# Altium project LimeNet-Micro_2v1-SDR.PrjPcb (part 11 of 11)
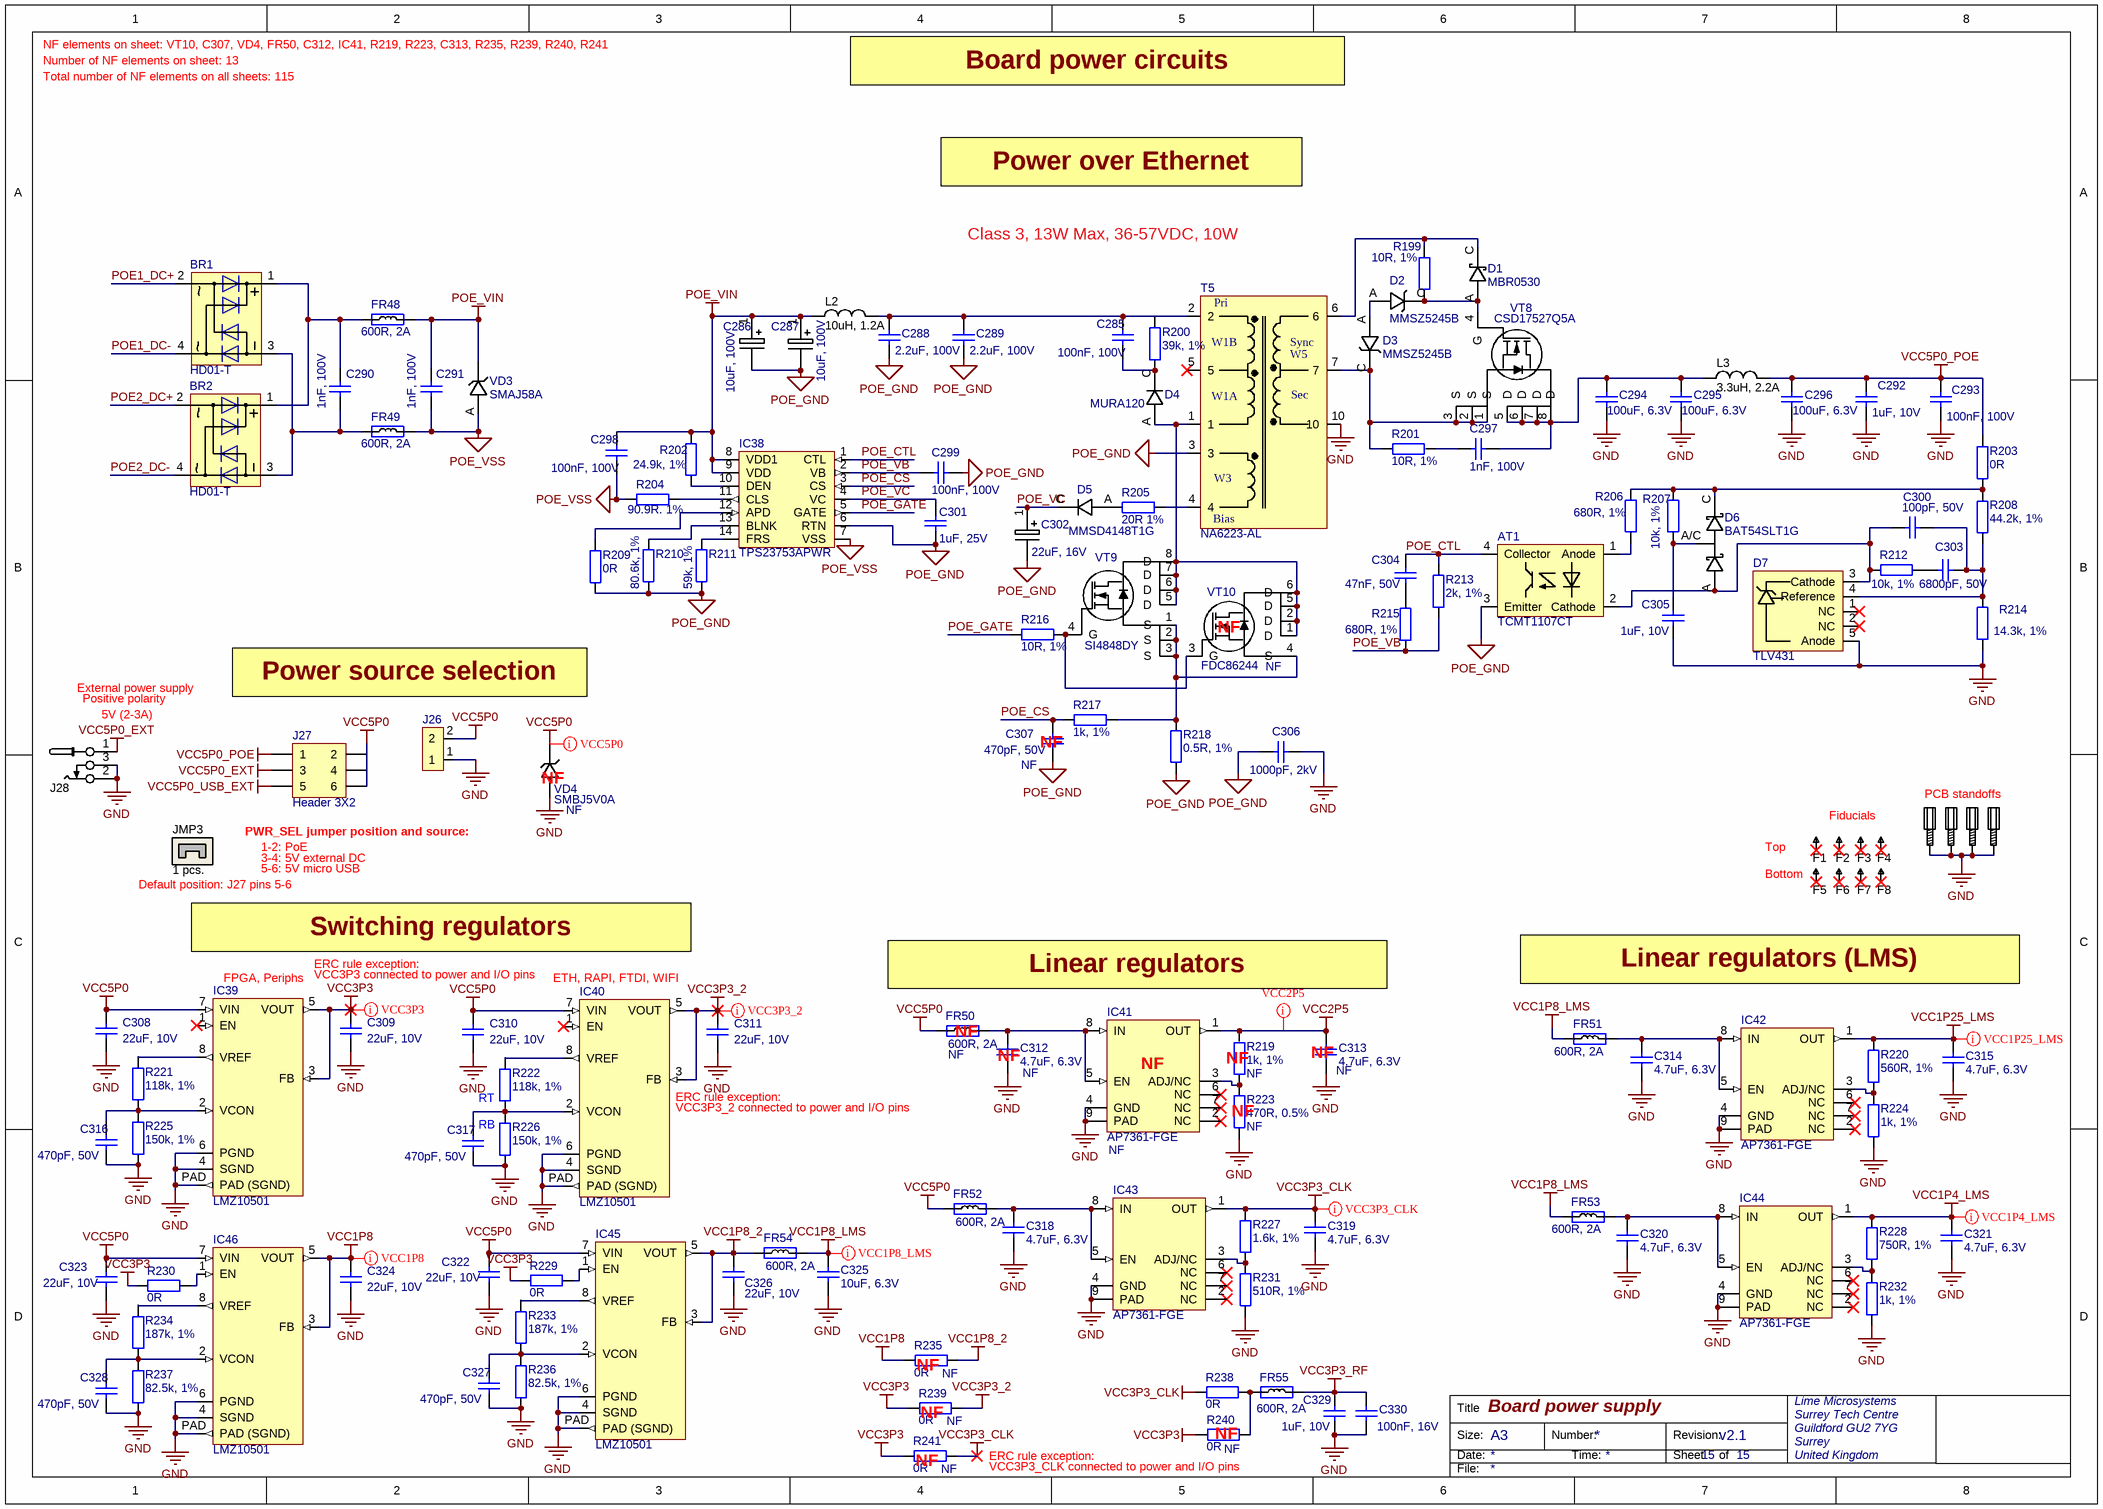
[diagram p116: 15_PowerSupply.SchDoc]

## Nets that join several sheets
GND: 05_LMS7002M_Misc (17 pins), 06_LMS7002M_RF (82 pins), 07_LMS7002M_Power (84 pins), 08_FPGA (61 pins), 09_Misc (63 pins), 10_USB_Ethernet (47 pins), 11_USB_FIFO (33 pins), 12_Raspbbery CM3 (80 pins), 13_Raspberry_Misc (73 pins), 14_Clocks (74 pins), 15_PowerSupply (69 pins)
RAPI_VDAC: 12_Raspbbery CM3 (5 pins), 13_Raspberry_Misc (VD2.2)
VCC1P4_LMS: 07_LMS7002M_Power (7 pins), 15_PowerSupply (C321.2 IC44.1 R228.1)
VCC1P8: 08_FPGA (11 pins), 09_Misc (R43.2 R69.1), 12_Raspbbery CM3 (R117.2 R124.1 R131.1), 13_Raspberry_Misc (5 pins), 15_PowerSupply (C324.2 IC46.3 IC46.5 R235.2)
VCC1P8_2: 14_Clocks (FR45.1), 15_PowerSupply (5 pins)
VCC1P8_LMS: 06_LMS7002M_RF (12 pins), 07_LMS7002M_Power (11 pins), 15_PowerSupply (C325.2 FR51.1 FR53.1 FR54.2)
VCC1P25_LMS: 07_LMS7002M_Power (18 pins), 15_PowerSupply (C315.2 IC42.1 R220.2)
VCC2P5: 12_Raspbbery CM3 (R128.1), 14_Clocks (R186.2), 15_PowerSupply (C313.2 IC41.1 R219.2)
VCC3P3: 05_LMS7002M_Misc (10 pins), 07_LMS7002M_Power (FR1.2), 08_FPGA (46 pins), 09_Misc (39 pins), 10_USB_Ethernet (J9.P6 J9.P12), 13_Raspberry_Misc (7 pins), 15_PowerSupply (8 pins)
VCC3P3_2: 10_USB_Ethernet (22 pins), 11_USB_FIFO (21 pins), 12_Raspbbery CM3 (13 pins), 13_Raspberry_Misc (19 pins), 15_PowerSupply (C311.2 IC40.3 IC40.5 R239.1)
VCC3P3_CLK: 09_Misc (FR36.1), 14_Clocks (12 pins), 15_PowerSupply (5 pins)
VCC3P3_RF: 06_LMS7002M_RF (8 pins), 15_PowerSupply (C329.2 C330.1 FR55.2)
VCC5P0: 08_FPGA (J3.7 R33.1), 09_Misc (R61.1), 10_USB_Ethernet (6 pins), 11_USB_FIFO (R103.2), 12_Raspbbery CM3 (R120.2), 13_Raspberry_Misc (6 pins), 15_PowerSupply (15 pins)
VCC5P0_USB_EXT: 10_USB_Ethernet (J12.4), 12_Raspbbery CM3 (J14.1 R122.1), 13_Raspberry_Misc (J15.1), 15_PowerSupply (J27.5)
ADF_MUXOUT: 08_FPGA (IC12.C10), 14_Clocks (IC36.15 R188.1)
BUZZER: 08_FPGA (IC12.D13), 09_Misc (R71.1 R73.1 VT2.G)
CAM1_CLK_N: 12_Raspbbery CM3 (J13.149), 13_Raspberry_Misc (J23.8)
CAM1_CLK_P: 12_Raspbbery CM3 (J13.147), 13_Raspberry_Misc (J23.9)
CAM1_D0_N: 12_Raspbbery CM3 (J13.161), 13_Raspberry_Misc (J23.2)
CAM1_D0_P: 12_Raspbbery CM3 (J13.159), 13_Raspberry_Misc (J23.3)
CAM1_D1_N: 12_Raspbbery CM3 (J13.155), 13_Raspberry_Misc (J23.5)
CAM1_D1_P: 12_Raspbbery CM3 (J13.153), 13_Raspberry_Misc (J23.6)
CAM1_GPIO0: 12_Raspbbery CM3 (J13.17), 13_Raspberry_Misc (J23.11)
CAM1_GPIO1: 12_Raspbbery CM3 (J13.15), 13_Raspberry_Misc (J23.12)
DSI1_CLK_N: 12_Raspbbery CM3 (J13.102), 13_Raspberry_Misc (J22.5)
DSI1_CLK_P: 12_Raspbbery CM3 (J13.100), 13_Raspberry_Misc (J22.6)
DSI1_D0_N: 12_Raspbbery CM3 (J13.96), 13_Raspberry_Misc (J22.8)
DSI1_D0_P: 12_Raspbbery CM3 (J13.94), 13_Raspberry_Misc (J22.9)
DSI1_D1_N: 12_Raspbbery CM3 (J13.120), 13_Raspberry_Misc (J22.2)
DSI1_D1_P: 12_Raspbbery CM3 (J13.118), 13_Raspberry_Misc (J22.3)
ETH_AUTOMDIX_EN: 09_Misc (IC19.3), 10_USB_Ethernet (IC24.41 R78.1)
ETH_CLK24: 10_USB_Ethernet (IC24.45), 14_Clocks (R169.2)
ETH_GPIO0: 08_FPGA (IC12.C2), 10_USB_Ethernet (R85.2)
ETH_GPIO1: 08_FPGA (IC12.G4), 10_USB_Ethernet (R88.2)
ETH_GPIO2: 08_FPGA (IC12.H1), 10_USB_Ethernet (R90.2)
ETH_LED1: 09_Misc (IC17.2), 10_USB_Ethernet (R87.1)
ETH_LED2: 09_Misc (IC17.3), 10_USB_Ethernet (R89.1)
ETH_NRESET: 09_Misc (IC19.4), 10_USB_Ethernet (IC24.12 R77.1)
ETH_USB0_D_N: 10_USB_Ethernet (IC24.58 J12.2), 13_Raspberry_Misc (IC31.2)
ETH_USB0_D_P: 10_USB_Ethernet (IC24.59 J12.3), 13_Raspberry_Misc (IC31.1)
ETH_USB5_D_N: 10_USB_Ethernet (IC24.8), 11_USB_FIFO (IC27.25)
ETH_USB5_D_P: 10_USB_Ethernet (IC24.9), 11_USB_FIFO (IC27.23)
FAN_CTRL: 08_FPGA (IC12.C5 R42.2), 09_Misc (VT1.G)
FPGA_BTN: 08_FPGA (IC12.H3), 09_Misc (C147.1 R69.2 SB1.1)
FPGA_I2C_SCL: 08_FPGA (IC12.K10), 09_Misc (6 pins), 12_Raspbbery CM3 (R126.1 R130.1)
FPGA_I2C_SDA: 08_FPGA (IC12.B10), 09_Misc (6 pins), 12_Raspbbery CM3 (R132.1 R134.1)
FPGA_SPI_ADF_SS: 09_Misc (IC19.15), 14_Clocks (R193.1)
FPGA_SPI_DAC_SS: 09_Misc (IC19.1), 14_Clocks (R196.2)
FPGA_SPI_LMS_SS: 05_LMS7002M_Misc (R9.2), 08_FPGA (IC12.J5)
FPGA_SPI_MISO: 05_LMS7002M_Misc (R8.2), 08_FPGA (IC12.N5), 09_Misc (IC23.2)
FPGA_SPI_MOSI: 05_LMS7002M_Misc (R7.2), 08_FPGA (IC12.K5), 09_Misc (IC23.5), 14_Clocks (R192.1 R198.2)
FPGA_SPI_SCLK: 05_LMS7002M_Misc (R6.2), 08_FPGA (IC12.M5), 09_Misc (IC23.6), 14_Clocks (R191.1 R197.2)
FT_BE0: 08_FPGA (IC12.H9), 11_USB_FIFO (IC27.4)
FT_BE1: 08_FPGA (IC12.G12), 11_USB_FIFO (IC27.5)
FT_BE2: 08_FPGA (IC12.H8), 11_USB_FIFO (IC27.6)
FT_BE3: 08_FPGA (IC12.K11), 11_USB_FIFO (IC27.7)
FT_CLK: 08_FPGA (IC12.G9), 11_USB_FIFO (IC27.58)
FT_D0: 08_FPGA (IC12.A2), 11_USB_FIFO (IC27.40)
FT_D1: 08_FPGA (IC12.A3), 11_USB_FIFO (IC27.41)
FT_D2: 08_FPGA (IC12.A4), 11_USB_FIFO (IC27.42)
FT_D3: 08_FPGA (IC12.A5), 11_USB_FIFO (IC27.43)
FT_D4: 08_FPGA (IC12.A6), 11_USB_FIFO (IC27.44)
FT_D5: 08_FPGA (IC12.A7), 11_USB_FIFO (IC27.45)
FT_D6: 08_FPGA (IC12.A8), 11_USB_FIFO (IC27.46)
FT_D7: 08_FPGA (IC12.A9), 11_USB_FIFO (IC27.47)
FT_D8: 08_FPGA (IC12.A12), 11_USB_FIFO (IC27.50)
FT_D9: 08_FPGA (IC12.B13), 11_USB_FIFO (IC27.51)
FT_D10: 08_FPGA (IC12.C13), 11_USB_FIFO (IC27.52)
FT_D11: 08_FPGA (IC12.B2), 11_USB_FIFO (IC27.53)
FT_D12: 08_FPGA (IC12.B3), 11_USB_FIFO (IC27.54)
FT_D13: 08_FPGA (IC12.B4), 11_USB_FIFO (IC27.55)
FT_D14: 08_FPGA (IC12.B5), 11_USB_FIFO (IC27.56)
FT_D15: 08_FPGA (IC12.B6), 11_USB_FIFO (IC27.57)
FT_D16: 08_FPGA (IC12.D9), 11_USB_FIFO (IC27.60)
FT_D17: 08_FPGA (IC12.E6), 11_USB_FIFO (IC27.61)
FT_D18: 08_FPGA (IC12.E8), 11_USB_FIFO (IC27.62)
FT_D19: 08_FPGA (IC12.F9), 11_USB_FIFO (IC27.63)
FT_D20: 08_FPGA (IC12.E9), 11_USB_FIFO (IC27.64)
FT_D21: 08_FPGA (IC12.E10), 11_USB_FIFO (IC27.65)
FT_D22: 08_FPGA (IC12.F8), 11_USB_FIFO (IC27.66)
FT_D23: 08_FPGA (IC12.B11), 11_USB_FIFO (IC27.67)
FT_D24: 08_FPGA (IC12.B12), 11_USB_FIFO (IC27.69)
FT_D25: 08_FPGA (IC12.C11), 11_USB_FIFO (IC27.70)
FT_D26: 08_FPGA (IC12.C12), 11_USB_FIFO (IC27.71)
FT_D27: 08_FPGA (IC12.F12), 11_USB_FIFO (IC27.72)
FT_D28: 08_FPGA (IC12.G13), 11_USB_FIFO (IC27.73)
FT_D29: 08_FPGA (IC12.H13), 11_USB_FIFO (IC27.74)
FT_D30: 08_FPGA (IC12.J13), 11_USB_FIFO (IC27.75)
FT_D31: 08_FPGA (IC12.L13), 11_USB_FIFO (IC27.76)
FT_OEn: 08_FPGA (IC12.J9), 11_USB_FIFO (IC27.13)
FT_RDn: 08_FPGA (IC12.D12), 11_USB_FIFO (IC27.12)
FT_RESETn: 09_Misc (IC19.5), 11_USB_FIFO (C181.1 IC27.15 R107.1)
FT_RXFn: 08_FPGA (IC12.K12), 11_USB_FIFO (IC27.9)
FT_TXEn: 08_FPGA (IC12.J12), 11_USB_FIFO (IC27.8)
FT_WAKEUPn: 08_FPGA (IC12.H10), 11_USB_FIFO (IC27.16 R106.1)
FT_WRn: 08_FPGA (IC12.E12), 11_USB_FIFO (IC27.11)
GNSS _UART_TX: 08_FPGA (IC12.D8 R39.2), 09_Misc (IC14.20 R56.2)
GNSS_TPULSE: 08_FPGA (IC12.J10), 09_Misc (IC14.3)
GNSS_UART_RX: 08_FPGA (IC12.L12), 09_Misc (IC14.21 R57.1)
GNSS_USB_D_N: 09_Misc (IC14.5), 10_USB_Ethernet (R96.2)
GNSS_USB_D_P: 09_Misc (IC14.6), 10_USB_Ethernet (R97.2)
HDMI_CEC: 12_Raspbbery CM3 (J13.171), 13_Raspberry_Misc (R150.2 VT7.S)
HDMI_CLK_N: 12_Raspbbery CM3 (J13.111), 13_Raspberry_Misc (J19.12)
HDMI_CLK_P: 12_Raspbbery CM3 (J13.113), 13_Raspberry_Misc (J19.10)
HDMI_D0_N: 12_Raspbbery CM3 (J13.117), 13_Raspberry_Misc (J19.9)
HDMI_D0_P: 12_Raspbbery CM3 (J13.119), 13_Raspberry_Misc (J19.7)
HDMI_D1_N: 12_Raspbbery CM3 (J13.123), 13_Raspberry_Misc (J19.6)
HDMI_D1_P: 12_Raspbbery CM3 (J13.125), 13_Raspberry_Misc (J19.4)
HDMI_D2_N: 12_Raspbbery CM3 (J13.129), 13_Raspberry_Misc (J19.3)
HDMI_D2_P: 12_Raspbbery CM3 (J13.131), 13_Raspberry_Misc (J19.1)
HDMI_HPD_N: 12_Raspbbery CM3 (J13.88), 13_Raspberry_Misc (R151.2 VT6.D)
HDMI_I2C_SCL: 12_Raspbbery CM3 (J13.175), 13_Raspberry_Misc (J19.15 VD1.A3)
HDMI_I2C_SDA: 12_Raspbbery CM3 (J13.173), 13_Raspberry_Misc (J19.16 VD1.B3)
LM75_OS: 08_FPGA (IC12.H2), 09_Misc (IC13.3 R43.1)
LMK_CLK: 08_FPGA (IC12.H6), 14_Clocks (IC34.15)
LMS_CORE_LDO_EN: 05_LMS7002M_Misc (IC1.U33 R5.1), 09_Misc (IC17.5)
LMS_DIQ1_D0: 05_LMS7002M_Misc (IC1.AG31), 08_FPGA (IC12.N12)
LMS_DIQ1_D1: 05_LMS7002M_Misc (IC1.AF30), 08_FPGA (IC12.M12)
LMS_DIQ1_D2: 05_LMS7002M_Misc (IC1.AF34), 08_FPGA (IC12.N11)
LMS_DIQ1_D3: 05_LMS7002M_Misc (IC1.AE31), 08_FPGA (IC12.L10)
LMS_DIQ1_D4: 05_LMS7002M_Misc (IC1.AD30), 08_FPGA (IC12.N9)
LMS_DIQ1_D5: 05_LMS7002M_Misc (IC1.AC29), 08_FPGA (IC12.M13)
LMS_DIQ1_D6: 05_LMS7002M_Misc (IC1.AE33), 08_FPGA (IC12.M10)
LMS_DIQ1_D7: 05_LMS7002M_Misc (IC1.AD32), 08_FPGA (IC12.N10)
LMS_DIQ1_D8: 05_LMS7002M_Misc (IC1.AC31), 08_FPGA (IC12.M8)
LMS_DIQ1_D9: 05_LMS7002M_Misc (IC1.AC33), 08_FPGA (IC12.M9)
LMS_DIQ1_D10: 05_LMS7002M_Misc (IC1.AB30), 08_FPGA (IC12.K6)
LMS_DIQ1_D11: 05_LMS7002M_Misc (IC1.AB32), 08_FPGA (IC12.K7)
LMS_DIQ2_D0: 05_LMS7002M_Misc (IC1.H30), 08_FPGA (IC12.M1)
LMS_DIQ2_D1: 05_LMS7002M_Misc (IC1.J31), 08_FPGA (IC12.L5)
LMS_DIQ2_D2: 05_LMS7002M_Misc (IC1.K30), 08_FPGA (IC12.K2)
LMS_DIQ2_D3: 05_LMS7002M_Misc (IC1.K32), 08_FPGA (IC12.M2)
LMS_DIQ2_D4: 05_LMS7002M_Misc (IC1.L31), 08_FPGA (IC12.M4)
LMS_DIQ2_D5: 05_LMS7002M_Misc (IC1.K34), 08_FPGA (IC12.J1)
LMS_DIQ2_D6: 05_LMS7002M_Misc (IC1.M30), 08_FPGA (IC12.L2)
LMS_DIQ2_D7: 05_LMS7002M_Misc (IC1.M32), 08_FPGA (IC12.K1)
LMS_DIQ2_D8: 05_LMS7002M_Misc (IC1.N31), 08_FPGA (IC12.N4)
LMS_DIQ2_D9: 05_LMS7002M_Misc (IC1.N33), 08_FPGA (IC12.J2)
LMS_DIQ2_D10: 05_LMS7002M_Misc (IC1.P30), 08_FPGA (IC12.L4)
LMS_DIQ2_D11: 05_LMS7002M_Misc (IC1.P32), 08_FPGA (IC12.N2)
LMS_ENABLE_IQSEL1: 05_LMS7002M_Misc (IC1.Y32), 08_FPGA (IC12.N7)
LMS_ENABLE_IQSEL2: 05_LMS7002M_Misc (IC1.R33), 08_FPGA (IC12.N3)
LMS_FCLK1: 05_LMS7002M_Misc (IC1.AA33), 08_FPGA (IC12.L3)
LMS_FCLK2: 05_LMS7002M_Misc (IC1.R29), 08_FPGA (IC12.M3)
LMS_MCLK1: 05_LMS7002M_Misc (IC1.AB34), 08_FPGA (IC12.G5)
LMS_MCLK2: 05_LMS7002M_Misc (IC1.P34), 08_FPGA (IC12.H4)
LMS_RESET: 05_LMS7002M_Misc (IC1.E27 R2.1), 09_Misc (IC17.4)
LMS_RXEN: 05_LMS7002M_Misc (IC1.V34 R4.2), 09_Misc (IC17.6)
LMS_TXEN: 05_LMS7002M_Misc (IC1.U29 R3.2), 09_Misc (IC17.7)
LMS_TXNRX1: 05_LMS7002M_Misc (IC1.V32 R1.1), 08_FPGA (IC12.N6)
LMS_TXNRX2: 05_LMS7002M_Misc (IC1.U31 R10.1), 08_FPGA (IC12.C4 R41.2)
POE1_DC+: 10_USB_Ethernet (J9.P10), 15_PowerSupply (BR1.2)
POE1_DC-: 10_USB_Ethernet (J9.P11), 15_PowerSupply (BR1.4)
POE2_DC+: 10_USB_Ethernet (J9.P8), 15_PowerSupply (BR2.2)
POE2_DC-: 10_USB_Ethernet (J9.P9), 15_PowerSupply (BR2.4)
RAPI_EMMC_EN: 08_FPGA (IC12.E1), 12_Raspbbery CM3 (J13.90 R131.2 VT4.G)
RAPI_GPCLK1: 08_FPGA (IC12.H5), 12_Raspbbery CM3 (J13.76)
RAPI_GPCLK2: 12_Raspbbery CM3 (J13.78), 14_Clocks (R166.2)
RAPI_GPIO12: 08_FPGA (IC12.F10), 12_Raspbbery CM3 (J13.45)
RAPI_I2C0_SCL: 12_Raspbbery CM3 (J13.5 R126.2 R127.2), 13_Raspberry_Misc (J22.11 J23.13)
RAPI_I2C0_SDA: 12_Raspbbery CM3 (J13.3 R132.2 R133.2), 13_Raspberry_Misc (J22.12 J23.14)
RAPI_PWM0: 12_Raspbbery CM3 (J13.70), 13_Raspberry_Misc (IC32.1)
RAPI_PWM1: 12_Raspbbery CM3 (J13.72), 13_Raspberry_Misc (IC32.3)
RAPI_RUN: 09_Misc (IC19.6), 12_Raspbbery CM3 (R114.2)
RAPI_SD1_CLK: 12_Raspbbery CM3 (R112.2), 13_Raspberry_Misc (IC30.6)
RAPI_SD1_CMD: 12_Raspbbery CM3 (J13.54), 13_Raspberry_Misc (IC30.7)
RAPI_SD1_D0: 12_Raspbbery CM3 (J13.58), 13_Raspberry_Misc (IC30.2)
RAPI_SD1_D1: 12_Raspbbery CM3 (J13.60), 13_Raspberry_Misc (IC30.3)
RAPI_SD1_D2: 12_Raspbbery CM3 (J13.64), 13_Raspberry_Misc (IC30.4)
RAPI_SD1_D3: 12_Raspbbery CM3 (J13.66), 13_Raspberry_Misc (IC30.5)
RAPI_SDX_CLK: 12_Raspbbery CM3 (J13.10), 13_Raspberry_Misc (R139.1)
RAPI_SDX_CMD: 12_Raspbbery CM3 (J13.12), 13_Raspberry_Misc (R137.1)
RAPI_SDX_D0: 12_Raspbbery CM3 (J13.16), 13_Raspberry_Misc (R140.1)
RAPI_SDX_D1: 12_Raspbbery CM3 (J13.18), 13_Raspberry_Misc (R142.1)
RAPI_SDX_D2: 12_Raspbbery CM3 (J13.22), 13_Raspberry_Misc (R135.1)
RAPI_SDX_D3: 12_Raspbbery CM3 (J13.24), 13_Raspberry_Misc (R136.1)
RAPI_SPI0_CE0: 08_FPGA (IC12.E13), 12_Raspbbery CM3 (J13.27)
RAPI_SPI0_MISO: 08_FPGA (IC12.K8), 12_Raspbbery CM3 (J13.29)
RAPI_SPI0_MOSI: 08_FPGA (IC12.M11), 12_Raspbbery CM3 (J13.33)
RAPI_SPI0_SCLK: 08_FPGA (IC12.F13), 12_Raspbbery CM3 (J13.35)
RAPI_SPI1_CE0: 08_FPGA (IC12.A10), 12_Raspbbery CM3 (J13.63)
RAPI_SPI1_MISO: 08_FPGA (IC12.L11), 12_Raspbbery CM3 (J13.65)
RAPI_SPI1_MOSI: 08_FPGA (IC12.K13), 12_Raspbbery CM3 (J13.69)
RAPI_SPI1_SCLK: 08_FPGA (IC12.G10), 12_Raspbbery CM3 (J13.71)
RAPI_TVDAC: 12_Raspbbery CM3 (J13.166), 13_Raspberry_Misc (J21.1 VD2.3)
RAPI_UART0_RX: 12_Raspbbery CM3 (J13.53), 13_Raspberry_Misc (J17.3)
RAPI_UART0_TX: 12_Raspbbery CM3 (J13.51), 13_Raspberry_Misc (J17.2)
RAPI_UART1_RX: 09_Misc (R56.1), 12_Raspbbery CM3 (J13.48)
RAPI_UART1_TX: 09_Misc (R57.2), 12_Raspbbery CM3 (J13.46)
RAPI_USB_D_N: 12_Raspbbery CM3 (J13.167), 13_Raspberry_Misc (IC28.2)
RAPI_USB_D_P: 12_Raspbbery CM3 (J13.165), 13_Raspberry_Misc (IC28.1)
RFSW_RX_V1: 06_LMS7002M_RF (C31.2 IC9.5), 09_Misc (IC22.6)
RFSW_RX_V2: 06_LMS7002M_RF (C30.2 IC9.2), 09_Misc (IC22.7)
RFSW_RXI_V1: 06_LMS7002M_RF (C35.2 IC10.10), 09_Misc (IC22.5)
RFSW_TRXA_V1: 06_LMS7002M_RF (C27.2 IC8.10), 09_Misc (IC22.3)
RFSW_TRXB_V1: 06_LMS7002M_RF (C37.2 IC11.10), 09_Misc (IC22.4)
RFSW_TX_V1: 06_LMS7002M_RF (C21.2 IC6.5), 09_Misc (IC22.15)
RFSW_TX_V2: 06_LMS7002M_RF (C20.2 IC6.2), 09_Misc (IC22.1)
RFSW_TXO_V1: 06_LMS7002M_RF (C11.2 IC4.10), 09_Misc (IC22.2)
RxPLL_CLK: 05_LMS7002M_Misc (IC1.AM24), 14_Clocks (C242.2 R167.1)
SR_DIN: 08_FPGA (IC12.B7), 09_Misc (IC15.14)
SR_LATCH: 08_FPGA (IC12.D6), 09_Misc (5 pins)
SR_SCLK: 08_FPGA (IC12.B9 R38.2), 09_Misc (IC15.11 IC17.11 IC19.11 IC22.11)
TxPLL_CLK: 05_LMS7002M_Misc (IC1.E5), 14_Clocks (C241.2 R164.1)
USB_BOOT: 12_Raspbbery CM3 (5 pins), 13_Raspberry_Misc (VT5.G)
WIFI_PIO5: 08_FPGA (IC12.C9), 13_Raspberry_Misc (IC30.27)
WIFI_RST: 12_Raspbbery CM3 (J13.47), 13_Raspberry_Misc (R149.1)